# EasyEDA schematic Voltage-Detector.json
TITLE: Sheet_1; REV: 1.0; Date: 2026-05-20; Sheet: 1/1; Drawn By: helmut-f; Company: Your Company
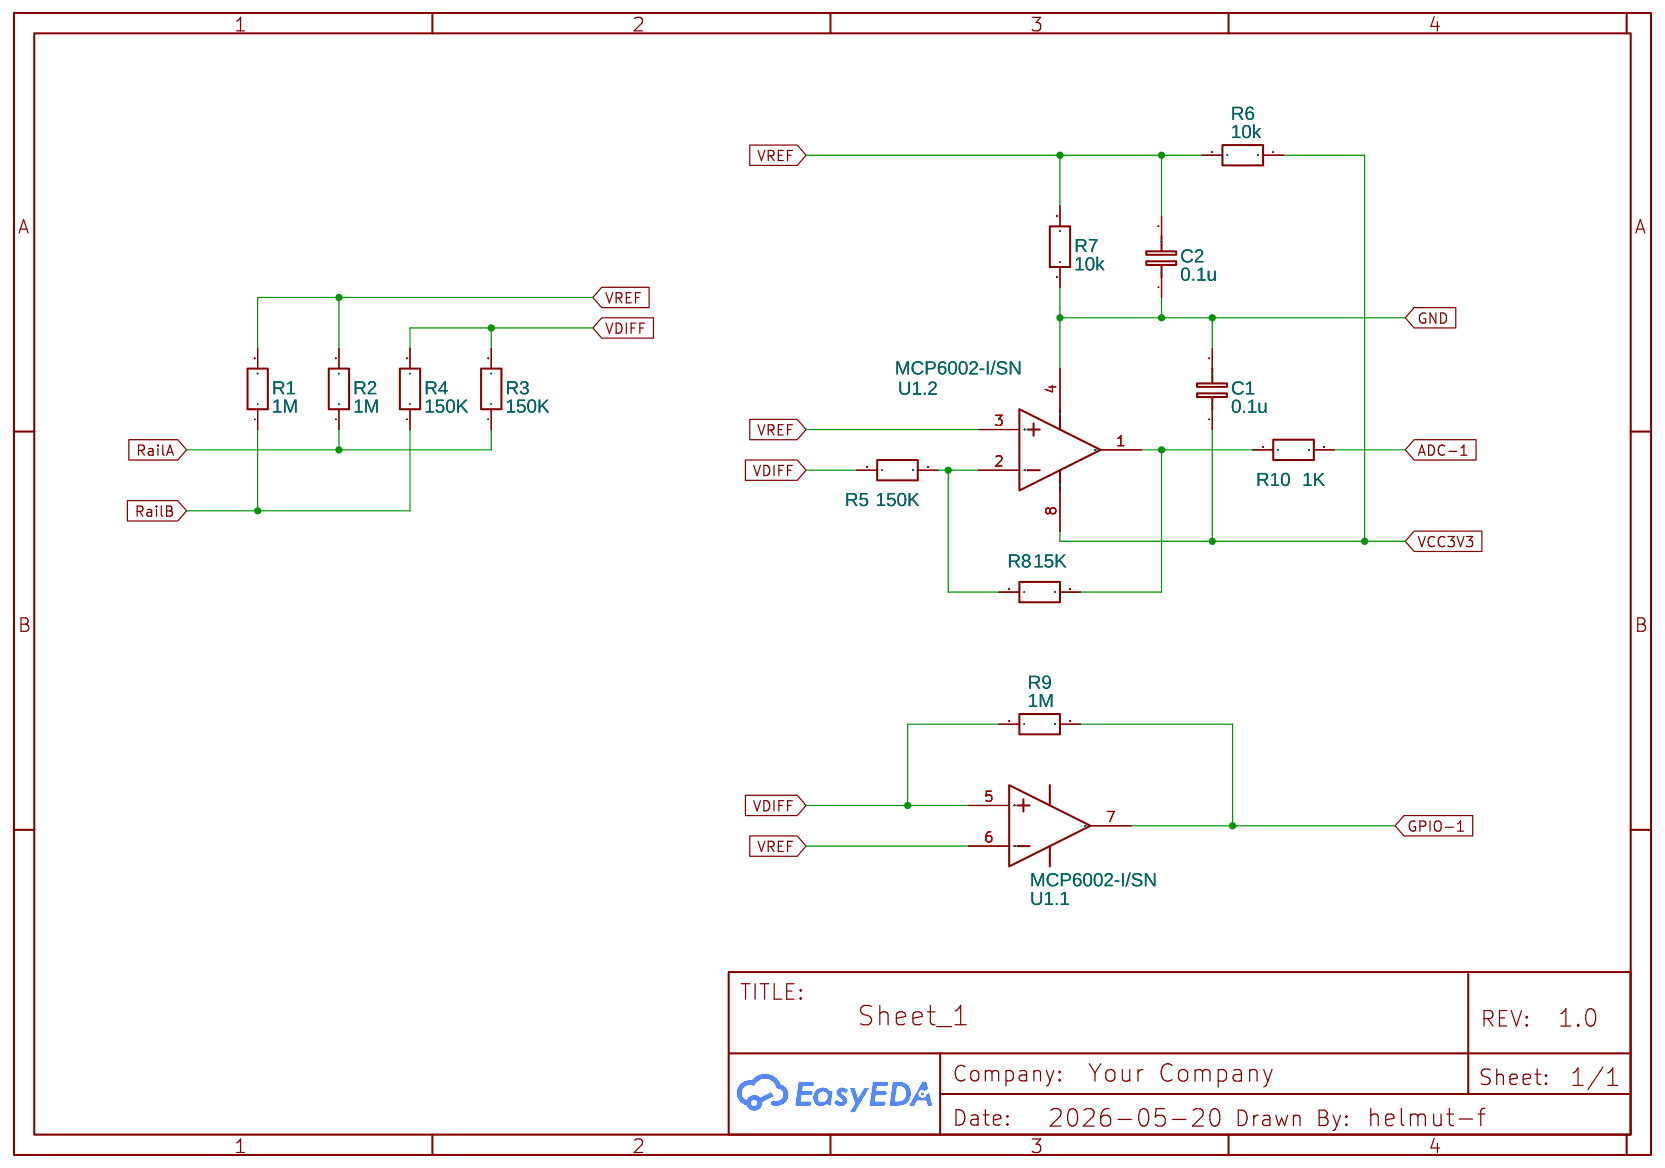
[diagram p0: schematic sheet]

## Parts
C1  0.1u  [C1206]
C2  0.1u  [C1206]
R1  1M  [R1206]
R2  1M  [R1206]
R3  150K  [R1206]
R4  150K  [R1206]
R5  150K  [R1206]
R6  10k  [R1206]
R7  10k  [R1206]
R8  15K  [R1206]
R9  1M  [R1206]
R10  1K  [R1206]
U1  MCP6002-I/SN  [SOIC-8_L4.9-W3.9-P1.27-LS6.0-BL]  (sections 1,2)

## Library data of the parts
C1 C2 = C_1206_EU: Contributor: LCEDA_Lib
R1-R10 = R_1206_EU: Contributor: LCEDA_Lib
U1 = MCP6002-I/SN: Operating Temperature: -40°C ~ 85°C; subpart_no: 1; Supplier Part: C116706; Supplier: LCSC; Manufacturer: MICROCHIP(美国微芯); JLCPCB Part Class: Extended Part

## Nets
GND: C1.2 C2.1 R7.1 U1.4(VSS)
VCC3V3: C1.1 R6.1 U1.8(VDD)
ADC-1: R10.2
GPIO-1: R9.2 U1.7(VOUTB)
RailA: R2.1 R3.1
RailB: R1.1 R4.1
VDIFF: R3.2 R4.2 R5.1 R9.1 U1.5(VINB+)
VREF: C2.2 R1.2 R2.2 R6.2 R7.2 U1.3(VINA+) U1.6(VINB-)
Net-(R5-2): R5.2 R8.1 U1.2(VINA-)
Net-(R8-2): R8.2 R10.1 U1.1(VOUTA)
